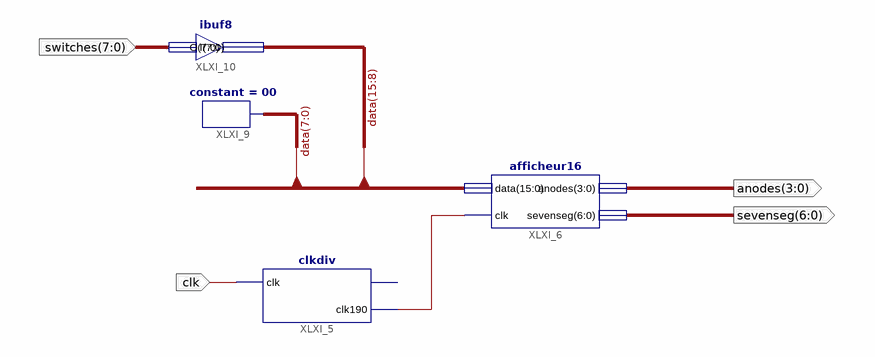
[diagram p0: schematic sheet 1]
// Xilinx ISE schematic toplevel.sch (spartan3e) as structural Verilog: 4 symbols, 4 ports
module toplevel (
  input  clk,
  input  [7:0] switches,
  output [3:0] anodes,
  output [6:0] sevenseg
);

  wire XLXN_10;
  wire [15:0] data;

  afficheur16 XLXI_6 (.data(data), .clk(XLXN_10), .anodes(anodes), .sevenseg(sevenseg));
  clkdiv XLXI_5 (.clk(clk), .clk190(XLXN_10));  // open: clksec
  constant #(.CValue("00")) XLXI_9 (.O(data[7:0]));
  ibuf8 XLXI_10 (.I(switches), .O(data[15:8]));
endmodule
